# Altium project TEBF0808.PrjPCB (part 5 of 6)

## Sheet FMC_MISC.SchDoc: TEBF0808 - FMC
size A4; Organization: Trenz Electronic GmbH; DocumentNumber: TEBF0808; Revision: 04; SheetNumber: 19; SheetTotal: 36; Date: 2016-09-29; CompanyName: Trenz Electronic GmbH; ProjectName: TEB0808 - LAN9514
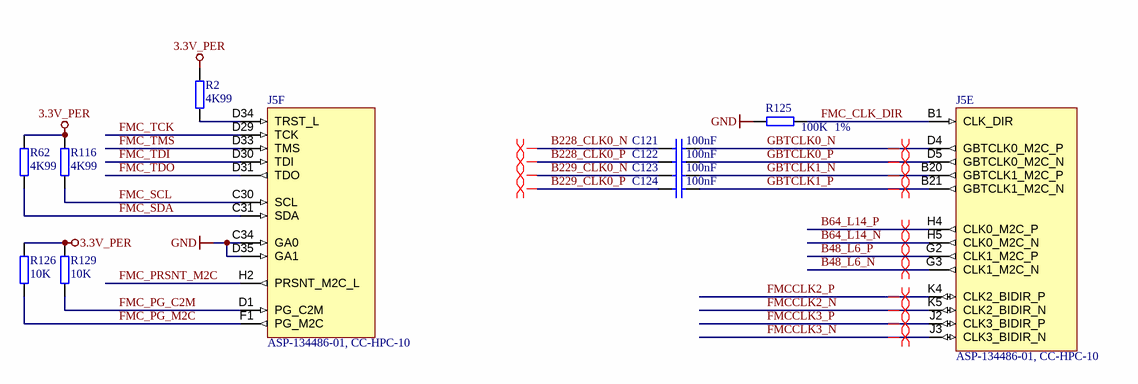
[diagram p31: FMC_MISC.SchDoc]

### Parts
C121  100nF  [CAPC0603X33N]
C122  100nF  [CAPC0603X33N]
C123  100nF  [CAPC0603X33N]
C124  100nF  [CAPC0603X33N]
J5  ASP-134486-01, CC-HPC-10  [ASP-134486-01B]  (parts E,F of 9)
R2  4K99  [RESC1005X40N]
R62  4K99  [RESC1005X40N]
R116  4K99  [RESC1005X40N]
R125  100K  Tolerance: 1%  [RESC1005X40N]
R126  10K  [RESC1005X40N]
R129  10K  [RESC1005X40N]

### Nets
3.3V_PER: R2.2 R62.2 R116.2 R126.2 R129.1
GND: J5.C34(GA0) J5.D35(GA1) R125.1
B48_L6_N: J5.G3(CLK1_M2C_N)
B48_L6_P: J5.G2(CLK1_M2C_P)
B64_L14_N: J5.H5(CLK0_M2C_N)
B64_L14_P: J5.H4(CLK0_M2C_P)
B228_CLK0_N: C121.1
B228_CLK0_P: C122.1
B229_CLK0_N: C123.1
B229_CLK0_P: C124.1
FMC_CLK_DIR: J5.B1(CLK_DIR) R125.2
FMC_PG_C2M: J5.D1(PG_C2M) R129.2
FMC_PG_M2C: J5.F1(PG_M2C) R126.1
FMC_PRSNT_M2C: J5.H2(PRSNT_M2C_L)
FMC_SCL: J5.C30(SCL) R116.1
FMC_SDA: J5.C31(SDA) R62.1
FMC_TCK: J5.D29(TCK)
FMC_TDI: J5.D30(TDI)
FMC_TDO: J5.D31(TDO)
FMC_TMS: J5.D33(TMS)
FMCCLK2_N: J5.K5(CLK2_BIDIR_N)
FMCCLK2_P: J5.K4(CLK2_BIDIR_P)
FMCCLK3_N: J5.J3(CLK3_BIDIR_N)
FMCCLK3_P: J5.J2(CLK3_BIDIR_P)
GBTCLK0_N: C121.2 J5.D4(GBTCLK0_M2C_P)
GBTCLK0_P: C122.2 J5.D5(GBTCLK0_M2C_N)
GBTCLK1_N: C123.2 J5.B20(GBTCLK1_M2C_P)
GBTCLK1_P: C124.2 J5.B21(GBTCLK1_M2C_N)
NetJ5_D34: J5.D34(TRST_L) R2.1

### Layout directives
differential pair: B48_L6_N, B48_L6_P, B64_L14_N, B64_L14_P, B228_CLK0_N, B228_CLK0_P, B229_CLK0_N, B229_CLK0_P, FMCCLK2_N, FMCCLK2_P, FMCCLK3_N, FMCCLK3_P, GBTCLK0_N, GBTCLK0_P, GBTCLK1_N, GBTCLK1_P

### Notes on the sheet
- Title:
- Number:
- Rev.
- Date:
- A4
- Copyright:
- Page
- of
- Filename:

### Library data of the parts
C121-C124 = 24915: as C16 on sheet Audio; Voltage: 6.3V; Technology: X5R; Case: 0603 (0201); Tolerance: 10%
J5 = 24851: as J5 on sheet FMC; HelpURL: B:\AD\adlib\datasheet\Samtec; H-ART: ASP-134486-01
R2 R62 R116 = 22754: as R173 on sheet MISC; Case: 1005 (0402); Tolerance: 1%; Technology: TK100
R125 = 22558: as R192 on sheet CLK_MUX; Case: 1005 (0402); Technology: TK100; Value: 100K
R126 R129 = 22750: as R6 on sheet Audio; Tolerance: 1%; Case: 1005 (0402); Technology: TK100; Value: 10K

## Sheet BD.SchDoc: TEBF0808 - Block Diagram
size A4; PageSetup: Record=PageOptions|CenterHorizontal=True|CenterVertical=True|PrintScale=0.92|XCorrection=1.00|YCorrection=1.00|PrintKind=0|BorderSize=5000000|LeftOffset=0|BottomOffset=0|Orientation=2|PaperLength=1000|PaperWidth=1000|Scale=100|PaperSource=7|PrintQuality=-4|MediaType=1|DitherType=10|PrintScaleMode=1|PaperKind=A4; Organization: Trenz Electronic GmbH; DocumentNumber: TEBF0808; Revision: 04; SheetNumber: 35; SheetTotal: 36; Date: 2016-09-29; CompanyName: Trenz Electronic GmbH
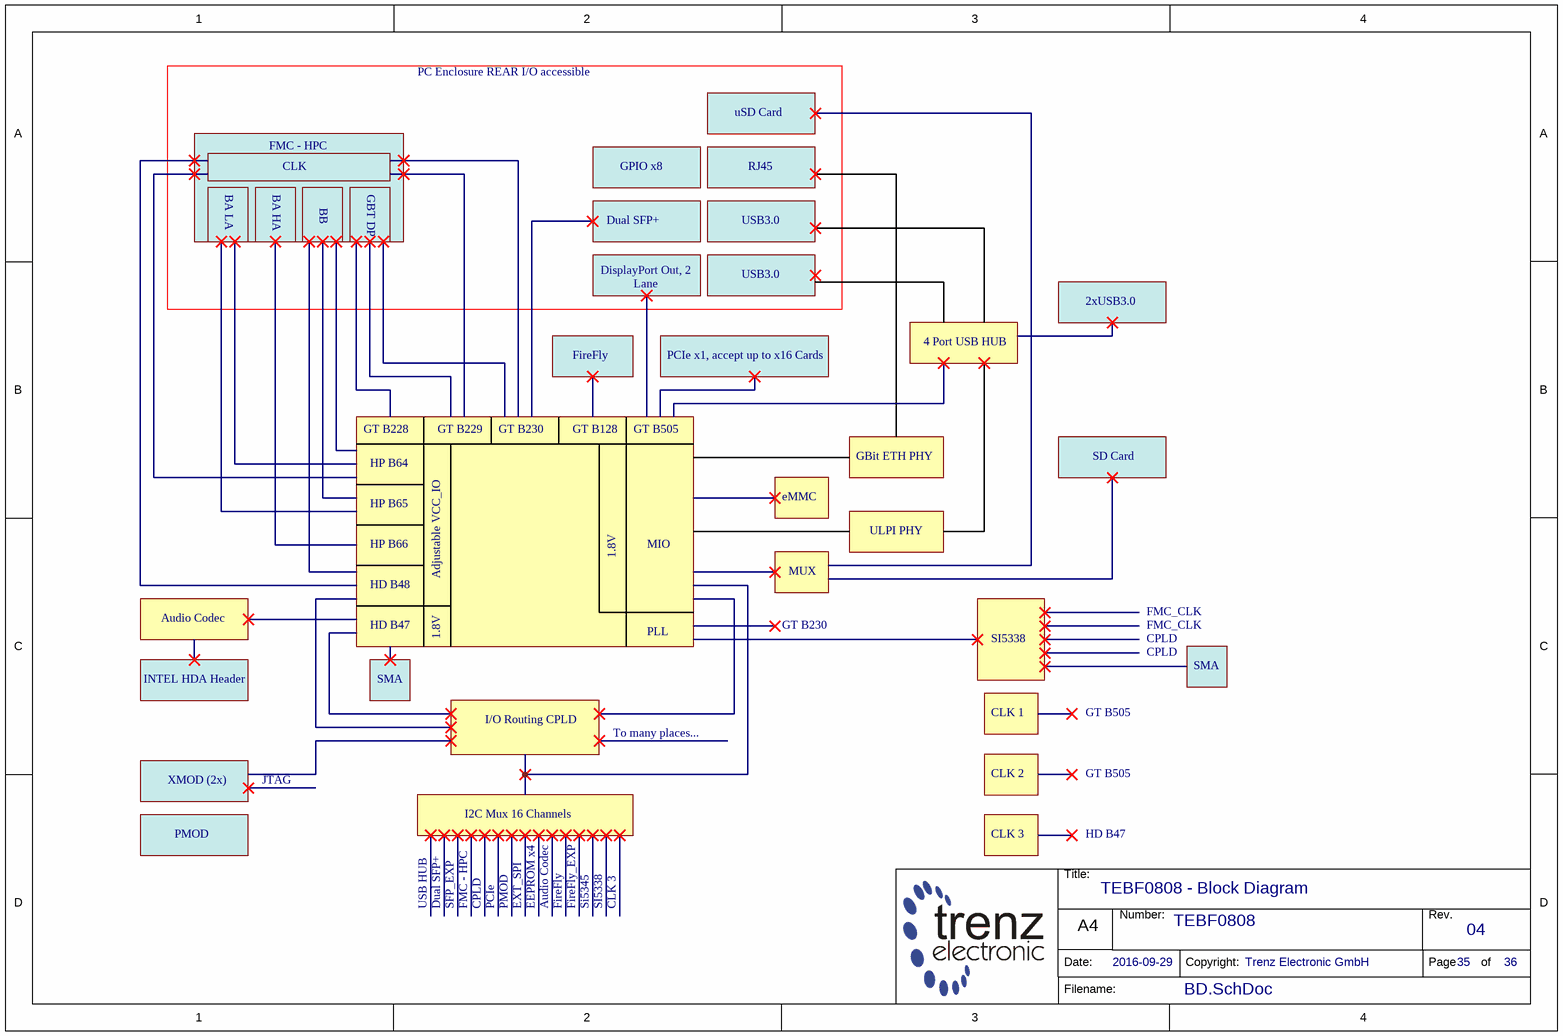
[diagram p32: BD.SchDoc]

### Notes on the sheet
- PC Enclosure REAR I/O accessible
- uSD Card
- FMC - HPC
- CLK
- GPIO x8
- RJ45
- BA LA
- BA HA
- BB
- GBT DP
- Dual SFP+
- USB3.0
- DisplayPort Out, 2 Lane
- 2xUSB3.0
- FireFly
- PCIe x1, accept up to x16 Cards
- 4 Port USB HUB
- GT B228
- GT B229
- GT B230
- GT B128
- GT B505
- HP B64
- HP B65
- eMMC
- GBit ETH PHY
- SD Card
- HP B66
- Adjustable VCC_IO
- 1.8V
- MIO
- MUX
- ULPI PHY
- Audio Codec
- HD B48
- HD B47
- PLL
- SI5338
- FMC_CLK
- CPLD
- INTEL HDA Header
- SMA
- CLK 1
- XMOD (2x)
- JTAG
- I/O Routing CPLD
- To many places...
- CLK 2
- PMOD
- I2C Mux 16 Channels
- CLK 3
- USB HUB
- SFP_EXP
- PCIe
- EXT_SPI
- EEPROM x4
- FireFly_EXP
- Si5345
- Title:
- Number:
- Rev.
- Date:
- A4
- Copyright:
- Page
- of
- Filename:

## Sheet PMODE.schdoc: TEBF0808 - MISC
size A4; DocumentNumber: TEBF0808; Revision: 04; SheetNumber: 30; SheetTotal: 36; Date: 2016-09-29; CompanyName: Trenz Electronic GmbH; Organization: Trenz Electronic GmbH
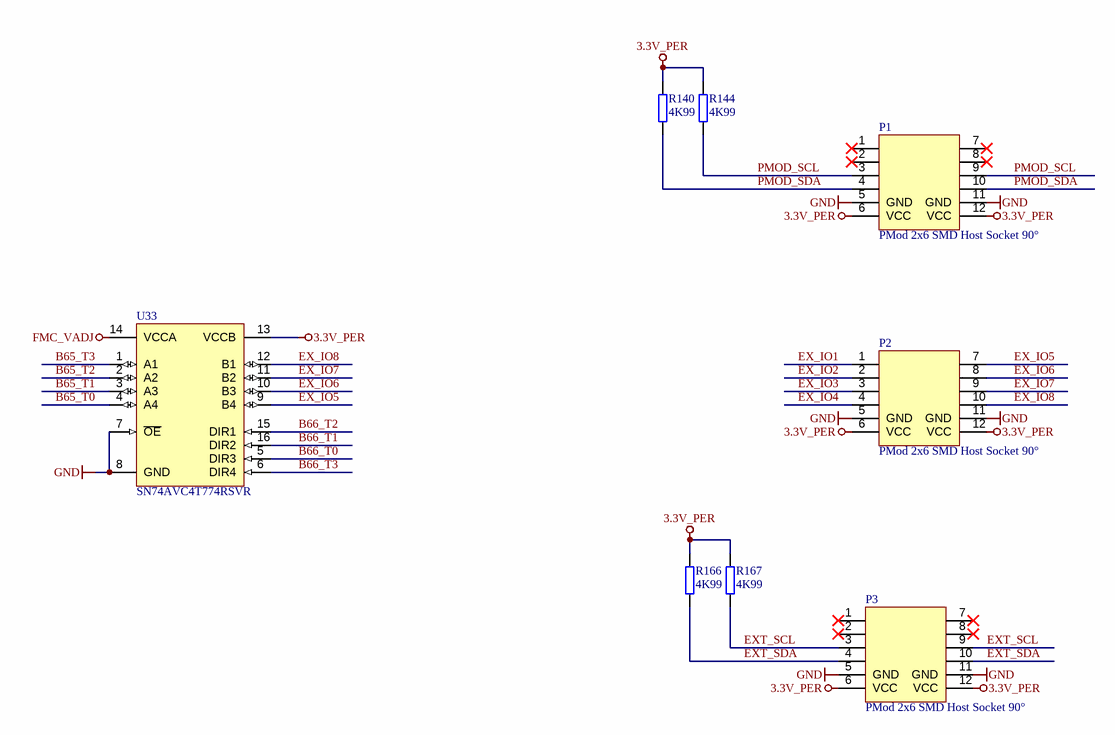
[diagram p33: PMODE.schdoc]

### Parts
P1  PMod 2x6 SMD Host Socket 90°  [610112249221]
P2  PMod 2x6 SMD Host Socket 90°  [610112249221]
P3  PMod 2x6 SMD Host Socket 90°  [610112249221]
R140  4K99  [RESC1005X40N]
R144  4K99  [RESC1005X40N]
R166  4K99  [RESC1005X40N]
R167  4K99  [RESC1005X40N]
U33  SN74AVC4T774RSVR  [QFN40P260X180X55-16N]

### Nets
3.3V_PER: P1.6(VCC) P1.12(VCC) P2.6(VCC) P2.12(VCC) P3.6(VCC) P3.12(VCC) R140.1 R144.1 R166.1 R167.1 U33.13(VCCB)
FMC_VADJ: U33.14(VCCA)
GND: P1.5(GND) P1.11(GND) P2.5(GND) P2.11(GND) P3.5(GND) P3.11(GND) U33.7(~{OE}) U33.8(GND)
B65_T0: U33.4(A4)
B65_T1: U33.3(A3)
B65_T2: U33.2(A2)
B65_T3: U33.1(A1)
B66_T0: U33.5(DIR3)
B66_T1: U33.16(DIR2)
B66_T2: U33.15(DIR1)
B66_T3: U33.6(DIR4)
EX_IO1: P2.1
EX_IO2: P2.2
EX_IO3: P2.3
EX_IO4: P2.4
EX_IO5: P2.7 U33.9(B4)
EX_IO6: P2.8 U33.10(B3)
EX_IO7: P2.9 U33.11(B2)
EX_IO8: P2.10 U33.12(B1)
EXT_SCL: P3.3 P3.9 R167.2
EXT_SDA: P3.4 P3.10 R166.2
PMOD_SCL: P1.3 P1.9 R144.2
PMOD_SDA: P1.4 P1.10 R140.2

Not connected (* = marked no-connect by the designer): P1 1* 2* 7* 8*; P3 1* 2* 7* 8*

### Notes on the sheet
- Title:
- Number:
- Rev.
- Date:
- A4
- Copyright:
- Page
- of
- Filename:

### Library data of the parts
P1-P3 = 27149: PMod 2x6 SMD Socket 90°; AN: 27149; Mixed: SMT; Trenz-Stock: Yes; HelpURL: B:\ad\adlib\datasheet\610112249221; H-ART: 610112249221
R140 R144 R166 R167 = 22754: as R173 on sheet MISC; Case: 1005 (0402); Tolerance: 1%; Technology: TK100
U33 = 27170: AN: 27170; Mixed: SMT; Trenz-Stock: Yes; Case: UQFN-16; HelpURL: B:\ad\adlib\datasheet\sn74avc4t774; H-ART: SN74AVC4T774RSVR

## Sheet SATA.schdoc: TEBF0808 - SATA
size A4; DocumentNumber: TEBF0808; Revision: 04; SheetNumber: 11; SheetTotal: 36; Date: 2016-09-29; CompanyName: Trenz Electronic GmbH; Organization: Trenz Electronic GmbH
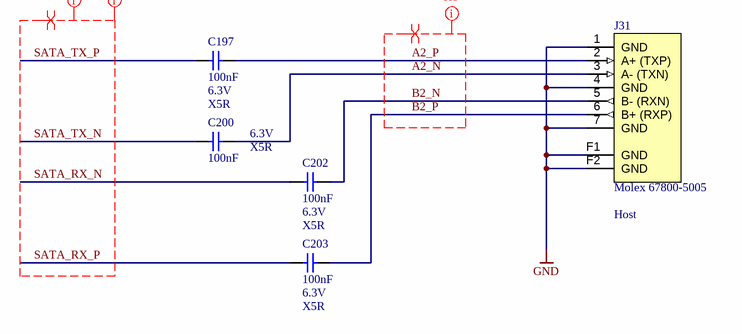
[diagram p34: SATA.schdoc]

### Parts
C197  100nF  Voltage: 6.3V  Technology: X5R  [CAPC0603X33N]
C200  100nF  Voltage: 6.3V  Technology: X5R  [CAPC0603X33N]
C202  100nF  Voltage: 6.3V  Technology: X5R  [CAPC0603X33N]
C203  100nF  Voltage: 6.3V  Technology: X5R  [CAPC0603X33N]
J31  Molex 67800-5005  [67800-5005]

### Nets
GND: J31.1(GND) J31.4(GND) J31.7(GND) J31.F1(GND) J31.F2(GND)
A2_N: C200.2 J31.3(A-_(TXN))
A2_P: C197.2 J31.2(A+_(TXP))
B2_N: C202.2 J31.5(B-_(RXN))
B2_P: C203.2 J31.6(B+_(RXP))
SATA_RX_N: C202.1
SATA_RX_P: C203.1
SATA_TX_N: C200.1
SATA_TX_P: C197.1

### Layout directives
differential pair: A2_N, A2_P, B2_N, B2_P, SATA_RX_N, SATA_RX_P, SATA_TX_N, SATA_TX_P
net class HS: A2_N, A2_P, B2_N, B2_P, SATA_RX_N, SATA_RX_P, SATA_TX_N, SATA_TX_P
net class SATA: SATA_RX_N, SATA_RX_P, SATA_TX_N, SATA_TX_P

### Notes on the sheet
- (near J31) Host
- Title:
- Number:
- Rev.
- Date:
- A4
- Copyright:
- Page
- of
- Filename:

### Library data of the parts
C197 C200 C202 C203 = 24915: as C16 on sheet Audio; Case: 0603 (0201); Tolerance: 10%
J31 = 25614: SATA 7Pol. Connector Vertical; AN: 25614; Mixed: SMT; HelpURL: B:\AD\adlib\datasheet\67800-5005; H-ART: 67800-5005

## Sheet Revision_Changes.SchDoc: TEBF0808 - Revision history
size A4; Organization: Trenz Electronic GmbH; DocumentNumber: TEBF0808; Revision: 04; SheetNumber: 36; SheetTotal: 36; Date: 2016-09-29; CompanyName: Trenz Electronic GmbH; PageSetup: Record=PageOptions|CenterHorizontal=True|CenterVertical=True|PrintScale=0.98|XCorrection=1.00|YCorrection=1.00|PrintKind=1|BorderSize=5000000|LeftOffset=0|BottomOffset=0|Orientation=2|PaperLength=1000|PaperWidth=1000|Scale=100|PaperSource=257|PrintQuality=600|MediaType=1|DitherType=10|PrintScaleMode=1|PaperKind=A4|PaperIndex=9
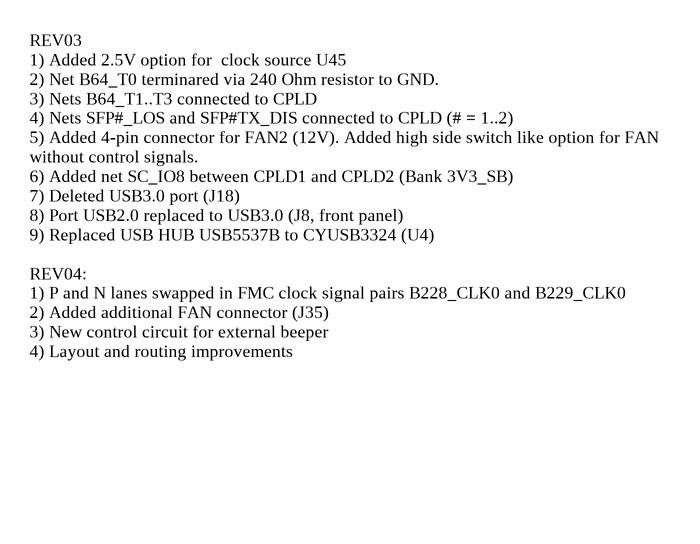
[diagram p35: Revision_Changes.SchDoc]

### Notes on the sheet
- REV03
  1) Added 2.5V option for  clock source U45
  2) Net B64_T0 terminared via 240 Ohm resistor to GND.
  3) Nets B64_T1..T3 connected to CPLD
  4) Nets SFP#_LOS and SFP#TX_DIS connected to CPLD (# = 1..2)
  5) Added 4-pin connector for FAN2 (12V). Added high side switch like option for FAN without control signals.
  6) Added net SC_IO8 between CPLD1 and CPLD2 (Bank 3V3_SB)
  7) Deleted USB3.0 port (J18)
  8) Port USB2.0 replaced to USB3.0 (J8, front panel)
  9) Replaced USB HUB USB5537B to CYUSB3324 (U4)
  REV04:
  1) P and N lanes swapped in FMC clock signal pairs B228_CLK0 and B229_CLK0
  2) Added additional FAN connector (J35)
  3) New control circuit for external beeper
  4) Layout and routing improvements
- Title:
- Number:
- Rev.
- Date:
- A4
- Copyright:
- Page
- of
- Filename: